# Altium schematic sheet rp3a0-mini-hdmi.SchDoc
size A4; SheetNumber: 4; SheetTotal: 6
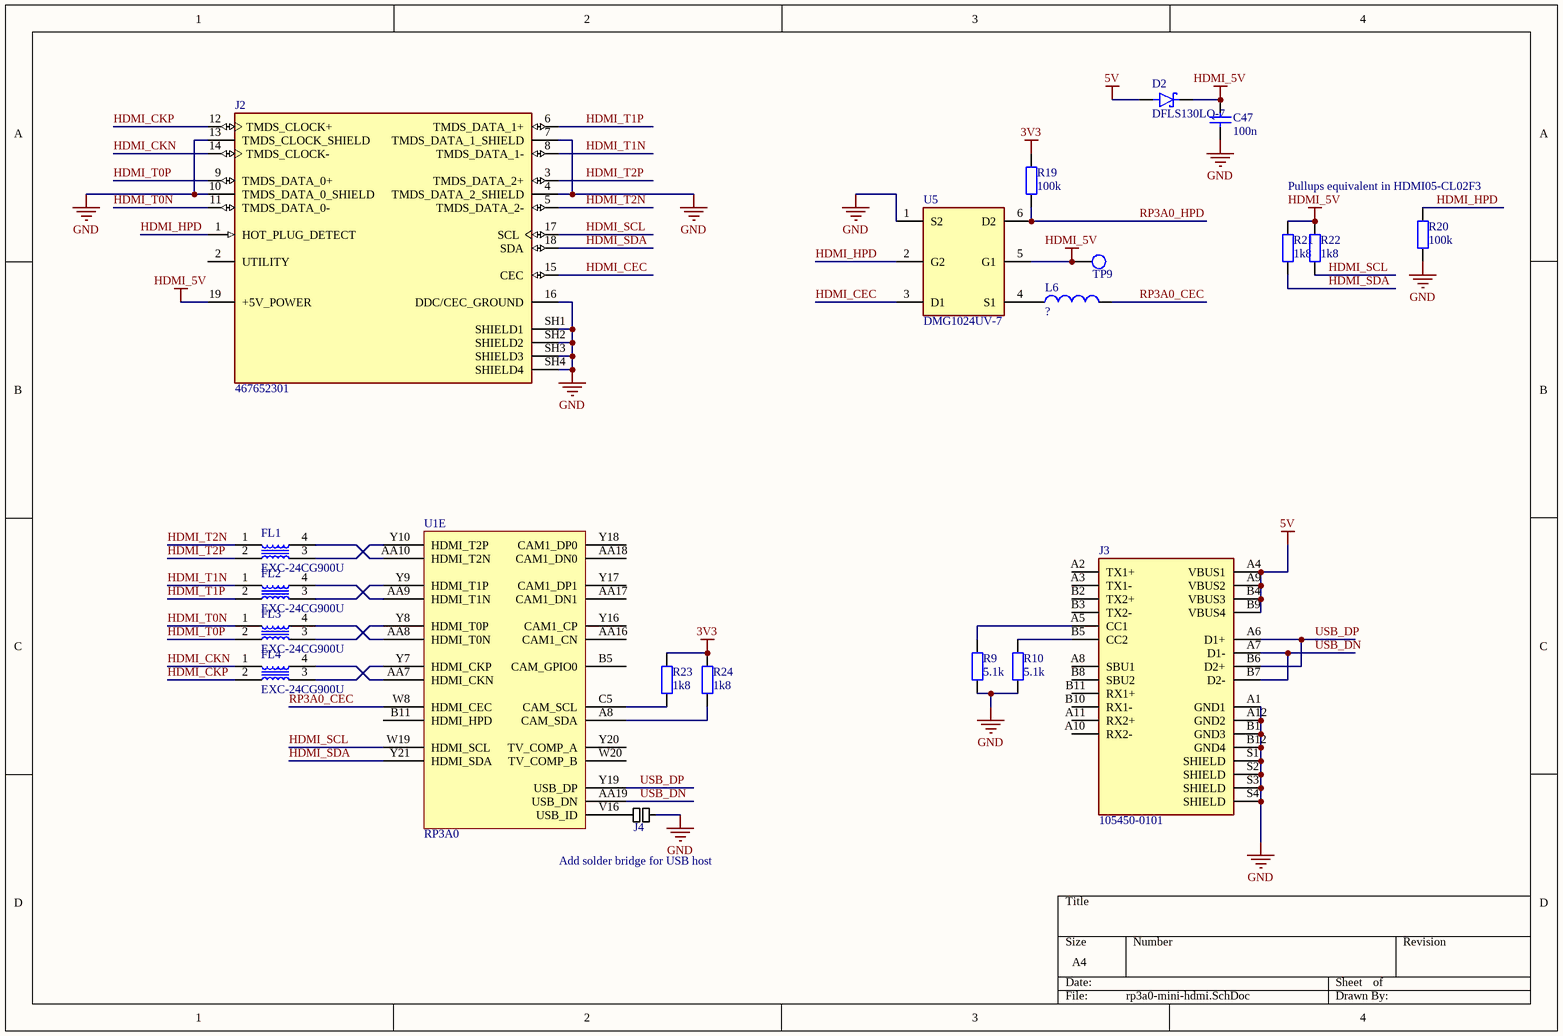
[diagram p0: rp3a0-mini-hdmi.SchDoc]

## Parts
C47  value 100n  [0402]  (hidden comment: Cap)
D2  DFLS130LQ-7  [DIO_DFLS130LQ-7]
FL1  EXC-24CG900U  [FIL_EXC24CB102U]
FL2  EXC-24CG900U  [FIL_EXC24CB102U]
FL3  EXC-24CG900U  [FIL_EXC24CB102U]
FL4  EXC-24CG900U  [FIL_EXC24CB102U]
J2  467652301  [MOLEX_467652301]
J3  105450-0101  [MOLEX_105450-0101]
J4  SOLDER_PAD_OPEN  [SOLDER_PAD_OPEN]  (value not drawn)  (net tie, no BOM)
L6  INDUCTOR  [0402]  (value not drawn)
R9  value 5.1k  [RES-0402-SML]  (hidden comment: Res SMD)
R10  value 5.1k  [RES-0402-SML]  (hidden comment: Res SMD)
R19  value 100k  [RES-0402-SML]  (hidden comment: Res SMD)
R20  value 100k  [RES-0402-SML]  (hidden comment: Res SMD)
R21  value 1k8  [RES-0402-SML]  (hidden comment: Res SMD)
R22  value 1k8  [RES-0402-SML]  (hidden comment: Res SMD)
R23  value 1k8  [RES-0402-SML]  (hidden comment: Res SMD)
R24  value 1k8  [RES-0402-SML]  (hidden comment: Res SMD)
TP9  TEST_POINT  [TEST_POINT_1.2MM]  (value not drawn)
U1  RP3A0  [RP3A0-BGA]  (part E of 8)
U5  DMG1024UV-7  [SOT50P162X60-6N]

## Nets
3V3: R19.2 R23.2 R24.2
5V: D2.A J3.A4(VBUS1) J3.A9(VBUS2) J3.B4(VBUS3) J3.B9(VBUS4)
GND: C47.1 J2.4(TMDS_DATA_2_SHIELD) J2.7(TMDS_DATA_1_SHIELD) J2.10(TMDS_DATA_0_SHIELD) J2.13(TMDS_CLOCK_SHIELD) J2.16(DDC/CEC_GROUND) J2.SH1(SHIELD1) J2.SH2(SHIELD2) J2.SH3(SHIELD3) J2.SH4(SHIELD4) J3.A1(GND1) J3.A12(GND2) J3.B1(GND3) J3.B12(GND4) J3.S1(SHIELD) J3.S2(SHIELD) J3.S3(SHIELD) J3.S4(SHIELD) J4.2 R9.1 R10.1 R20.1 U5.1(S2)
HDMI_5V: C47.2 D2.K J2.19(+5V_POWER) R21.2 R22.2 TP9.TP U5.5(G1)
HDMI_CEC: J2.15(CEC) U5.3(D1)
HDMI_CKN: FL4.1 J2.14(TMDS_CLOCK-)
HDMI_CKP: FL4.2 J2.12(TMDS_CLOCK+)
HDMI_HPD: J2.1(HOT_PLUG_DETECT) R20.2 U5.2(G2)
HDMI_SCL: J2.17(SCL) R22.1 U1.W19(HDMI_SCL)
HDMI_SDA: J2.18(SDA) R21.1 U1.Y21(HDMI_SDA)
HDMI_T0N: FL3.1 J2.11(TMDS_DATA_0-)
HDMI_T0P: FL3.2 J2.9(TMDS_DATA_0+)
HDMI_T1N: FL2.1 J2.8(TMDS_DATA_1-)
HDMI_T1P: FL2.2 J2.6(TMDS_DATA_1+)
HDMI_T2N: FL1.1 J2.5(TMDS_DATA_2-)
HDMI_T2P: FL1.2 J2.3(TMDS_DATA_2+)
RP3A0_CEC: L6.2 U1.W8(HDMI_CEC)
RP3A0_HPD: R19.1 U5.6(D2)
USB_DN: J3.A7(D1-) J3.B7(D2-) U1.AA19(USB_DN)
USB_DP: J3.A6(D1+) J3.B6(D2+) U1.Y19(USB_DP)
NetFL1_3: FL1.3 U1.Y10(HDMI_T2P)
NetFL1_4: FL1.4 U1.AA10(HDMI_T2N)
NetFL2_3: FL2.3 U1.Y9(HDMI_T1P)
NetFL2_4: FL2.4 U1.AA9(HDMI_T1N)
NetFL3_3: FL3.3 U1.Y8(HDMI_T0P)
NetFL3_4: FL3.4 U1.AA8(HDMI_T0N)
NetFL4_3: FL4.3 U1.Y7(HDMI_CKP)
NetFL4_4: FL4.4 U1.AA7(HDMI_CKN)
NetJ3_A5: J3.A5(CC1) R9.2
NetJ3_B5: J3.B5(CC2) R10.2
NetJ4_1: J4.1 U1.V16(USB_ID)
NetL6_1: L6.1 U5.4(S1)
NetR23_1: R23.1 U1.C5(CAM_SCL)
NetR24_1: R24.1 U1.A8(CAM_SDA)

Not connected (* = marked no-connect by the designer): J2 2(UTILITY); J3 A2(TX1+) A3(TX1-) A8(SBU1) A10(RX2-) A11(RX2+) B2(TX2+) B3(TX2-) B8(SBU2) B10(RX1-) B11(RX1+); U1 AA16(CAM1_CN) AA17(CAM1_DN1) AA18(CAM1_DN0) B5(CAM_GPIO0) B11(HDMI_HPD) W20(TV_COMP_B) Y16(CAM1_CP) Y17(CAM1_DP1) Y18(CAM1_DP0) Y20(TV_COMP_A)

## Notes on the sheet
- Pullups equivalent in HDMI05-CL02F3
- Add solder bridge for USB host

## Library data of the parts
C47 = CAP-NONPOL: Capacitor
D2 = DFLS130LQ-7: Diode Schottky 1A 30V PowerDI 123 ¦ Diodes Inc DFLS130LQ-7; MF: Diodes Inc.; MP: DFLS1100-7; SnapEDA_Link: https://www.snapeda.com/parts/DFLS1100-7/Diodes+Inc./view-part/?ref=snap; Package: POWERDIÂ®123 Diodes Incorporated; Value: *; Check_prices: https://www.snapeda.com/parts/DFLS1100-7/Diodes+Inc./view-part/?ref=eda
FL1-FL4 = EXC-24CG900U: Series/Type: Common mode Filters(for Gbps), Size [LÃ—W] (mm): 1.25Ã—1.0, Height (mm): 0.5, Impedance [Common Mode] (â„¦): 90, Rated Voltage [DC] (V): 5, Rated Current [DC] (mA): 100, DC Resistance [max.] (â„¦): 3, Number of circuit: 1; MP: EXC24CG900U; MF: Panasonic; Package: 0504 Panasonic; Purchase-URL: https://pricing.snapeda.com/search/part/EXC24CG900U/?ref=eda; Availability: In Stock; Value: *; Price: None; Check_prices: https://www.snapeda.com/parts/EXC24CG900U/Panasonic/view-part/?ref=eda; SnapEDA_Link: https://www.snapeda.com/parts/EXC24CG900U/Panasonic/view-part/?ref=snap
J2 = 467652301: 0.40mm Pitch Micro HDMI Connector, Right-Angle Receptacle, Surface Mount, Hybrid Type Mount, with Pick-and-Place Polyimide Tape, 19 Circuits, Lead-Free; MF: Molex; SnapEDA_Link: https://www.snapeda.com/parts/467652301/Molex/view-part/?ref=snap; Package: None; Value: *; MP: 467652301; Check_prices: https://www.snapeda.com/parts/467652301/Molex/view-part/?ref=eda
J3 = 105450-0101: USB-C, USB 3.1 Gen 2, Receptacle Connector 24 Position Surface Mount, Right Angle; Through Hole; MF: Molex; MP: 1054500101; Package: None; Digi-Key_Part_Number: WM12856CT-ND; SnapEDA_Link: https://www.snapeda.com/parts/1054500101/Molex/view-part/448528/?ref=snap; Digi-Key_Purchase_URL: https://www.digikey.tw/product-detail/en/molex/1054500101/WM12856CT-ND/5843891?utm_source=snapeda&utm_medium=aggregator&utm_campaign=symbol; Value: *
J4 = SOLDER_PAD_OPEN: Solder pads with no connection
L6 = INDUCTOR: Inductor SMD; Value: ?
R9 R10 R19-R24 = Res SMD: Resistor
TP9 = TEST_POINT: Test point
U5 = DMG1024UV-7: Dual N-Ch Enhancement MOSFET SOT-563 | Diodes Inc DMG1024UV-7; MF: Diodes Inc.; SnapEDA_Link: https://www.snapeda.com/parts/DMG1024UV-7/Diodes+Inc./view-part/?ref=snap; Package: SOT-563 Diodes Inc.; Value: *; MP: DMG1024UV-7; Check_prices: https://www.snapeda.com/parts/DMG1024UV-7/Diodes+Inc./view-part/?ref=eda